# Altium schematic sheet power.SchDoc
size A4; SheetNumber: 1; SheetTotal: 3
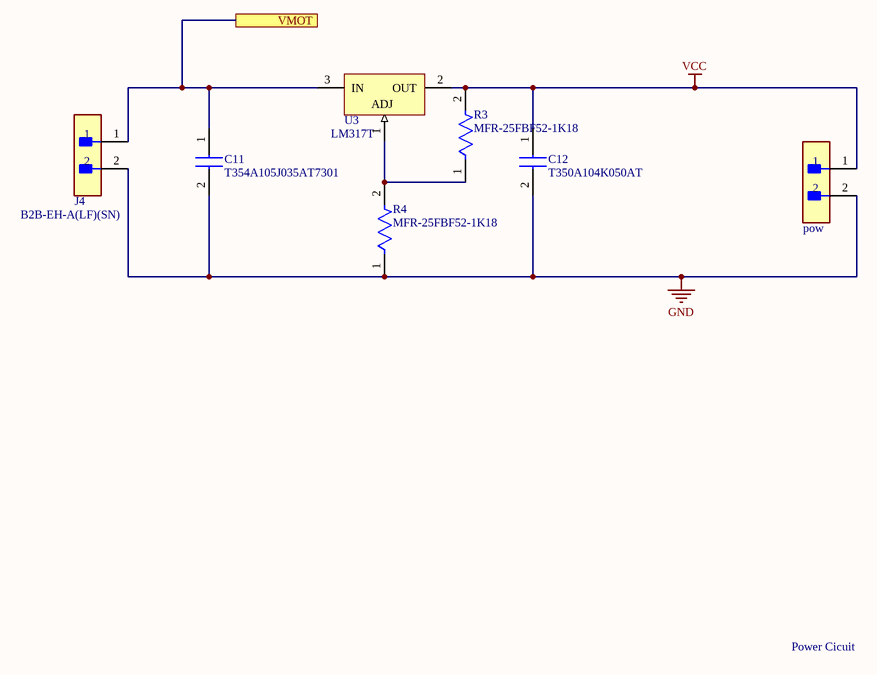
[diagram p0: power.SchDoc]

## Parts
C11  T354A105J035AT7301  [T354A105J035AT7301]
C12  T350A104K050AT  [T350A104K050AT]
J4  B2B-EH-A(LF)(SN)  [FP-B2B-EH-A_LF_SN-MFG]
pow  1-TX 2-RX  [FP-M22-2010205-MFG]  (value not drawn)
R3  MFR-25FBF52-1K18  [FP-MFR-25-MFG]
R4  MFR-25FBF52-1K18  [FP-MFR-25-MFG]
U3  LM317T  [NDE0003A]

## Ports
VMOT

## Nets
GND: C11.2(-) C12.2 J4.2 pow.2 R4.1
VCC: C12.1 pow.1 R3.2 U3.2(OUT)
VMOT: C11.1(+) J4.1 U3.3(IN) ; port VMOT
NetR3_1: R3.1 R4.2 U3.1(ADJ)

## Notes on the sheet
- Power Cicuit

## Library data of the parts
C11 = T354A105J035AT7301: Capacitor; Manufacturer_Name: KEMET; Datasheet Link: https://content.kemet.com/datasheets/KEM_T2043_T35X.pdf; Height: 8.6mm; Manufacturer_Part_Number: T354A105J035AT7301; Mouser Part Number: 80-T354A105J35AT-TR; Mouser Price/Stock: https://www.mouser.co.uk/ProductDetail/KEMET/T354A105J035AT7301?qs=eaG68hM7nzPCdlzS1u%252BjMg%3D%3D
C12 = T350A104K050AT: Capacitor; Manufacturer_Name: KEMET; Datasheet Link: https://content.kemet.com/datasheets/KEM_T2043_T35X.pdf; Height: 7.1mm; Manufacturer_Part_Number: T350A104K050AT; Mouser Part Number: 80-T350A104K50AT; Mouser Price/Stock: https://www.mouser.co.uk/ProductDetail/KEMET/T350A104K050AT?qs=O4djsYW3Gvb%252Bsic1QYKKdw%3D%3D; Arrow Part Number: T350A104K050AT; Arrow Price/Stock: https://www.arrow.com/en/products/t350a104k050at/kemet-corporation?region=nac
J4 = CMP-17439-000026-1: CONN HEADER VERT 2POS 2.5MM; Number of Contacts: 2; Current Rating: 3A; Connector Type: Plug; Contact Resistance: 20mR; Gender: Male; Voltage Rating: 250V; Fastening Type: Detent; Depth: 3.8mm; Max Operating Temperature: 85°C; Orientation: Straight; Series: EH; Contact Plating: Tin; Min Operating Temperature: -25°C; Contact Type: Male Pin; Housing Color: White; Termination: Press-Fit; Housing Material: Nylon; Pitch: 2.5mm; Number of Positions: 2; Max Current Rating: 3A; Packaging: Bulk; Lead Free: Lead Free; Number of Rows: 1; Length: 7.5mm; Contact Mating Length: 0.13inch; Color: Natural; Max Voltage Rating (AC): 250V; Contact Material: Copper Alloy; Mount: Through Hole
pow = CMP-15831-000101-1: 1-SCL / 2-SDA; Max Current Rating: 1A; Connector Type: Male Pin; Voltage Rating (AC): 250V; Voltage Rating: 650V; Gender: Male; Pitch: 2mm; Mated Stacking Heights: 8.6mm; Number of Positions: 2; Insulation Resistance: 10GR; Contact Resistance: 20mR; Package Quantity: 1000; Insulation Material: Nylon; Contact Plating: Gold; Flammability Rating: UL94 V-0; Reach SVHC Compliant: Yes; Mount: Through Hole; Radiation Hardening: No; Depth: 2mm; Case/Package: SIL; Contact Finish - Mating: GOLD; Contact Type: Male Pin; Contact Shape: Square; Contact Material: Bronze; Min Operating Temperature: -55°C; Housing Material: Nylon; Insulation Color: Black; Current Rating: 1A; Contact Mating Length: 0.138inch; Number of Rows: 1; Length: 4mm; Color: Black; Orientation: Straight; Housing Color: Black; Series: M22; Fastening Type: Pull; Packaging: Bulk; Termination: Solder; Number of Contacts: 2; Max Operating Temperature: 105°C
R3 R4 = CMP-03413-000001-1: RES 1.18K OHM 1/4W 1% AXIAL; Manufacturer: Yageo; Value: 1.18kΩ; Temperature Coefficient: 100ppm/°C; Power Rating: 0.25W; Voltage Rating: 250V; Temperature: -55°C to +155°C; Automotive: No; Temperature Range High: +155°C; Mouser Description: Metal Film Resistors 1.18K OHM 1/4W 1%; Digikey Description: RES 1.18K OHM 1/4W 1% AXIAL; Lead Free: Yes; Tolerance: 1%; ComponentLink2Description: Datasheet; ComponentLink2URL: https://www.yageo.com/upload/media/product/products/datasheet/lr/Yageo_LR_MFR_1.pdf; Temperature Range Low: -55°C; Package: MFR-25; Ipc Land Pattern Name: RESAD1000W75L680D260; Composition: Metal Film; Category: Res; Octopart: https://octopart.com/mfr-25fbf52-1k18-yageo-56251681; Series: MFR; Device Class L2: Resistors; Height: 2.6mm; Resistance: 1.18kΩ; Device Class L3: Through-Hole Resistors; Manufacturer Part Number: MFR-25FBF52-1K18; RoHS: TRUE; Device Class L1: Passive Components
U3 = CMP-0062-02456-3: 3-Terminal Adjustable Regulator, 3-pin TO-220; Manufacturer: Texas Instruments; CompType: LDO IC; PowerWise: N; PackageTopMarking: NSUZXYTTE#*LM317T P+; ComponentLink1Description: Datasheet URL; PackageReference: NDE0003A; PinCount: 3; ComponentLink1URL: http://www.ti.com/general/docs/lit/getliterature.tsp?genericPartNumber=LM317-N&fileType=pdf; RoHS: N; PackageDescription: TO-220, Molded, 3 Lead, Straight